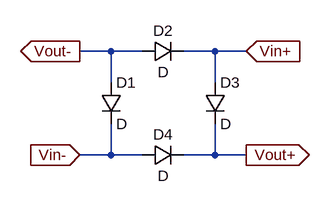
[diagram p0: schematic PuenteDeDiodosComponente.asc]
PuenteDeDiodosComponente.asc, the LTspice schematic file:
Version 4
SHEET 1 880 680
WIRE 128 112 80 112
WIRE 176 112 128 112
WIRE 288 112 240 112
WIRE 336 112 288 112
WIRE 128 160 128 112
WIRE 288 160 288 112
WIRE 128 272 128 224
WIRE 128 272 80 272
WIRE 176 272 128 272
WIRE 288 272 288 224
WIRE 288 272 240 272
WIRE 336 272 288 272
FLAG 336 112 Vin+
IOPIN 336 112 In
FLAG 336 272 Vout+
IOPIN 336 272 Out
FLAG 80 112 Vout-
IOPIN 80 112 Out
FLAG 80 272 Vin-
IOPIN 80 272 In
SYMBOL diode 112 160 R0
SYMATTR InstName D1
SYMBOL diode 176 128 R270
WINDOW 0 32 32 VTop 2
WINDOW 3 0 32 VBottom 2
SYMATTR InstName D2
SYMBOL diode 272 160 R0
SYMATTR InstName D3
SYMBOL diode 176 288 R270
WINDOW 0 32 32 VTop 2
WINDOW 3 0 32 VBottom 2
SYMATTR InstName D4

The netlist it stands for:
* PuenteDeDiodosComponente.asc
D1 Vout- Vin- D
D2 Vout- Vin+ D
D3 Vin+ Vout+ D
D4 Vin- Vout+ D
.model D D
.lib standard.dio
.backanno
.end